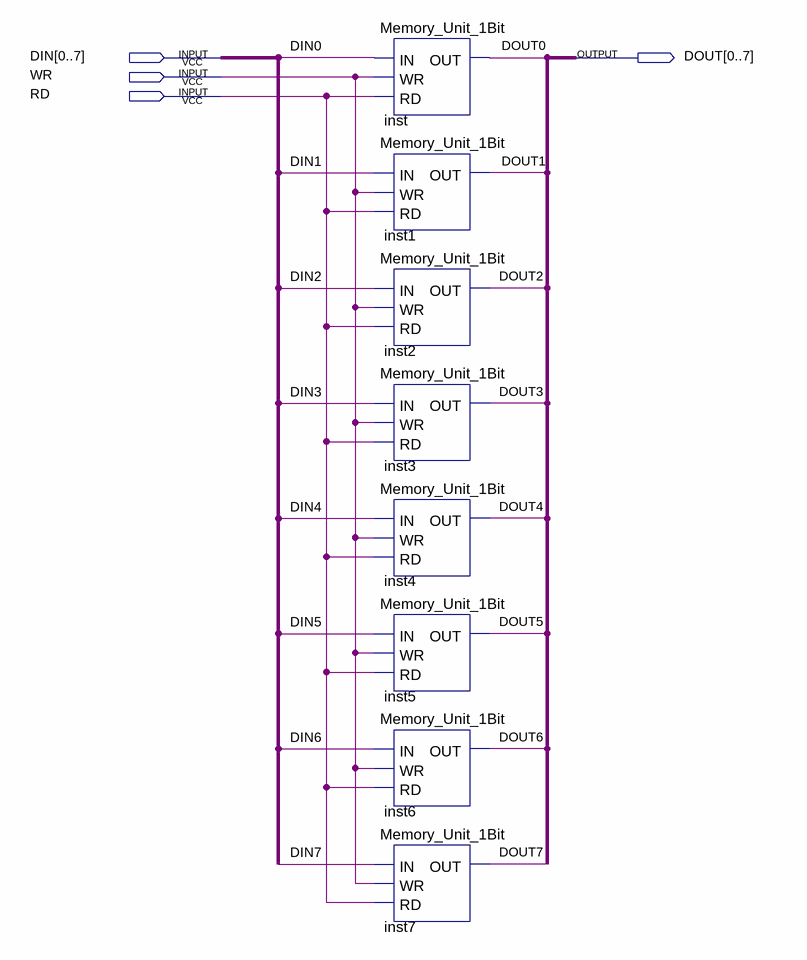
[diagram p0: schematic sheet]
// Quartus schematic Memory_Unit_1Byte.bdf as structural Verilog: 8 symbols, 4 pins
module Memory_Unit_1Byte (
  input  [0:7] DIN,
  input  WR,
  input  RD,
  output [0:7] DOUT
);

  Memory_Unit_1Bit inst (.IN(DIN[0]), .WR(WR), .RD(RD), .OUT(DOUT[0]));
  Memory_Unit_1Bit inst1 (.IN(DIN[1]), .WR(WR), .RD(RD), .OUT(DOUT[1]));
  Memory_Unit_1Bit inst2 (.IN(DIN[2]), .WR(WR), .RD(RD), .OUT(DOUT[2]));
  Memory_Unit_1Bit inst3 (.IN(DIN[3]), .WR(WR), .RD(RD), .OUT(DOUT[3]));
  Memory_Unit_1Bit inst4 (.IN(DIN[4]), .WR(WR), .RD(RD), .OUT(DOUT[4]));
  Memory_Unit_1Bit inst5 (.IN(DIN[5]), .WR(WR), .RD(RD), .OUT(DOUT[5]));
  Memory_Unit_1Bit inst6 (.IN(DIN[6]), .WR(WR), .RD(RD), .OUT(DOUT[6]));
  Memory_Unit_1Bit inst7 (.IN(DIN[7]), .WR(WR), .RD(RD), .OUT(DOUT[7]));
endmodule
